# EAGLE schematic adc_cap (EAGLE 7.1.0)
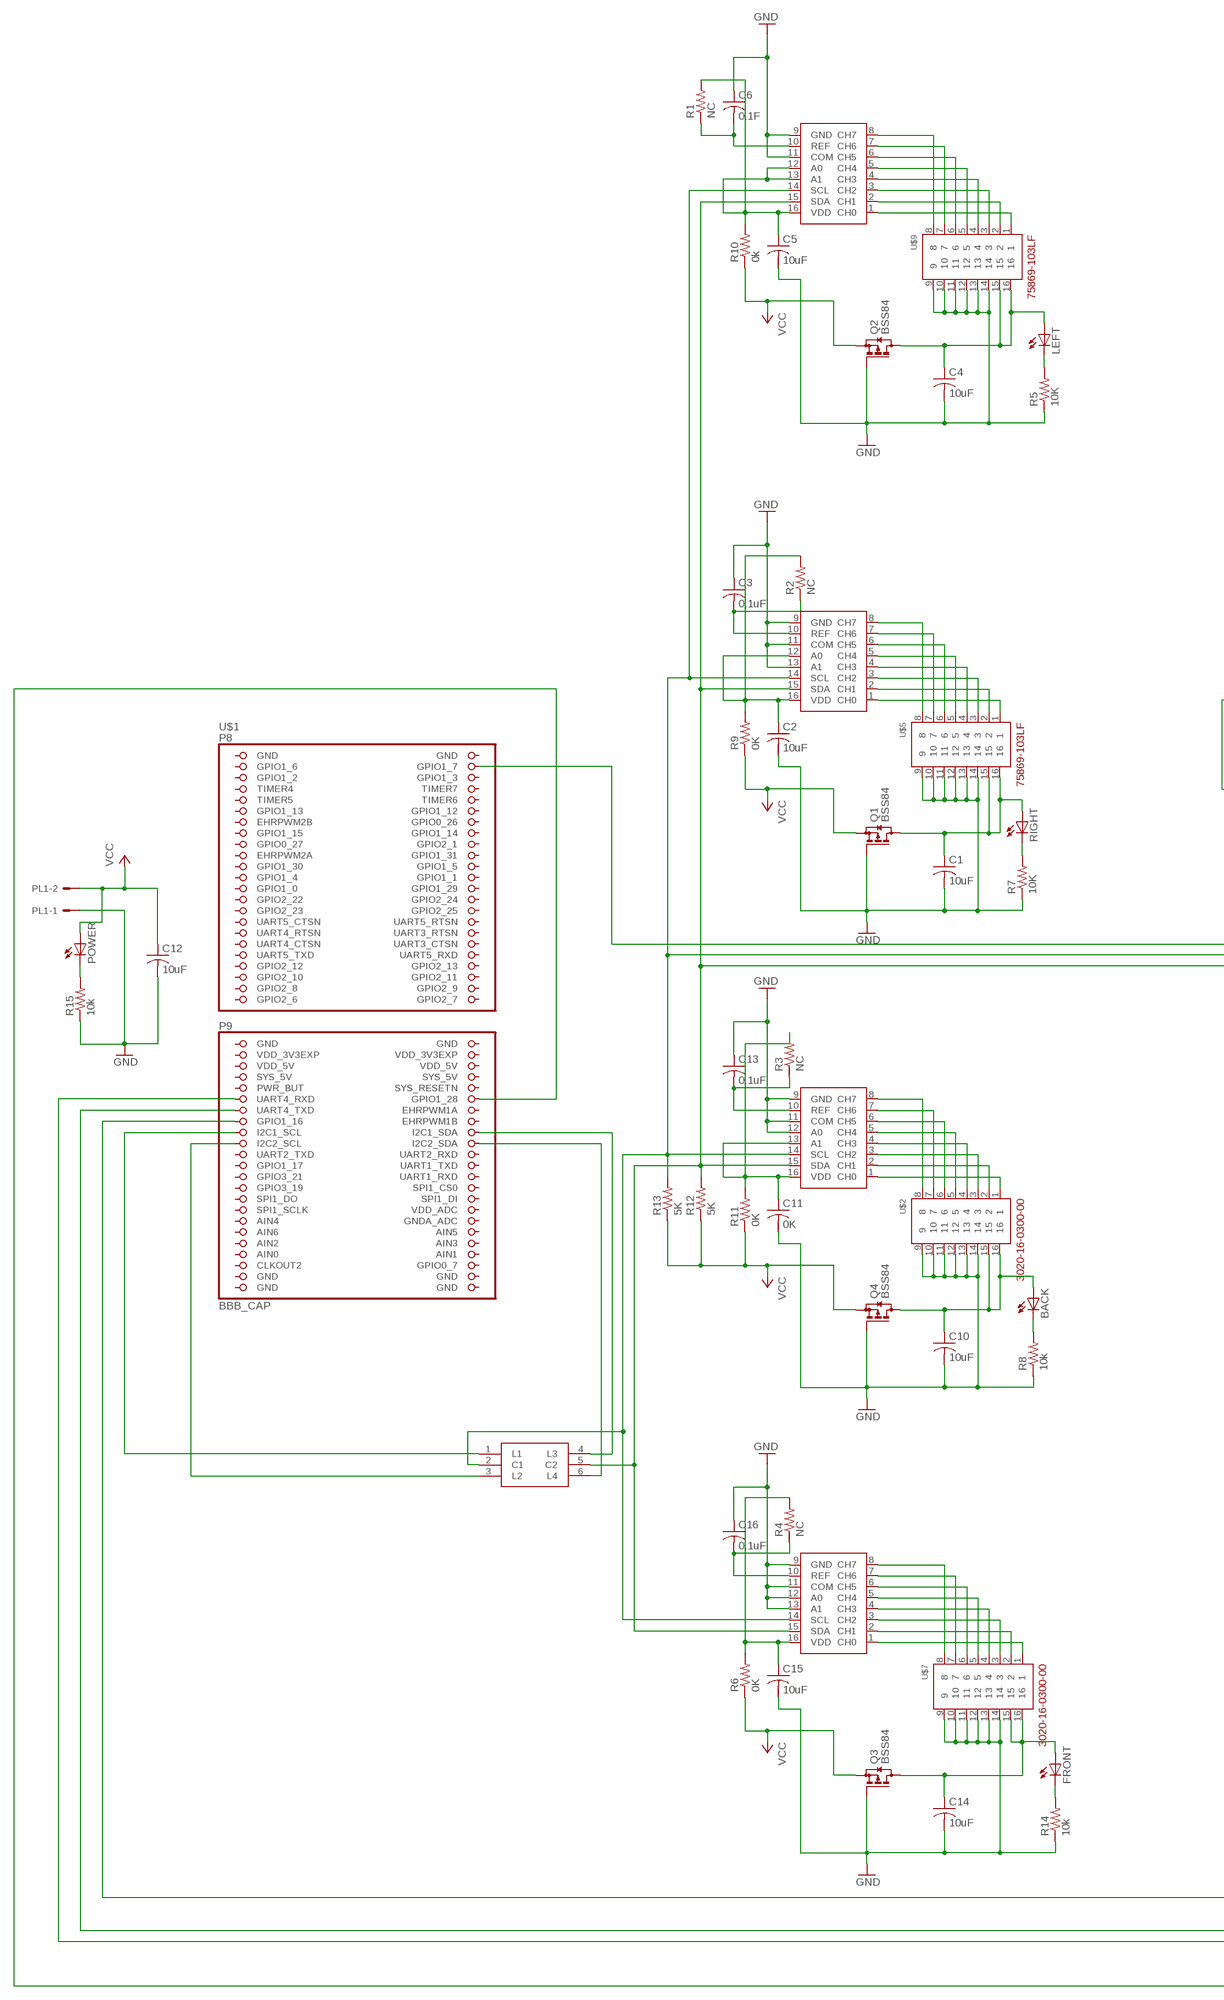
[diagram p0: schematic, sheet 1, part 1 of 2]
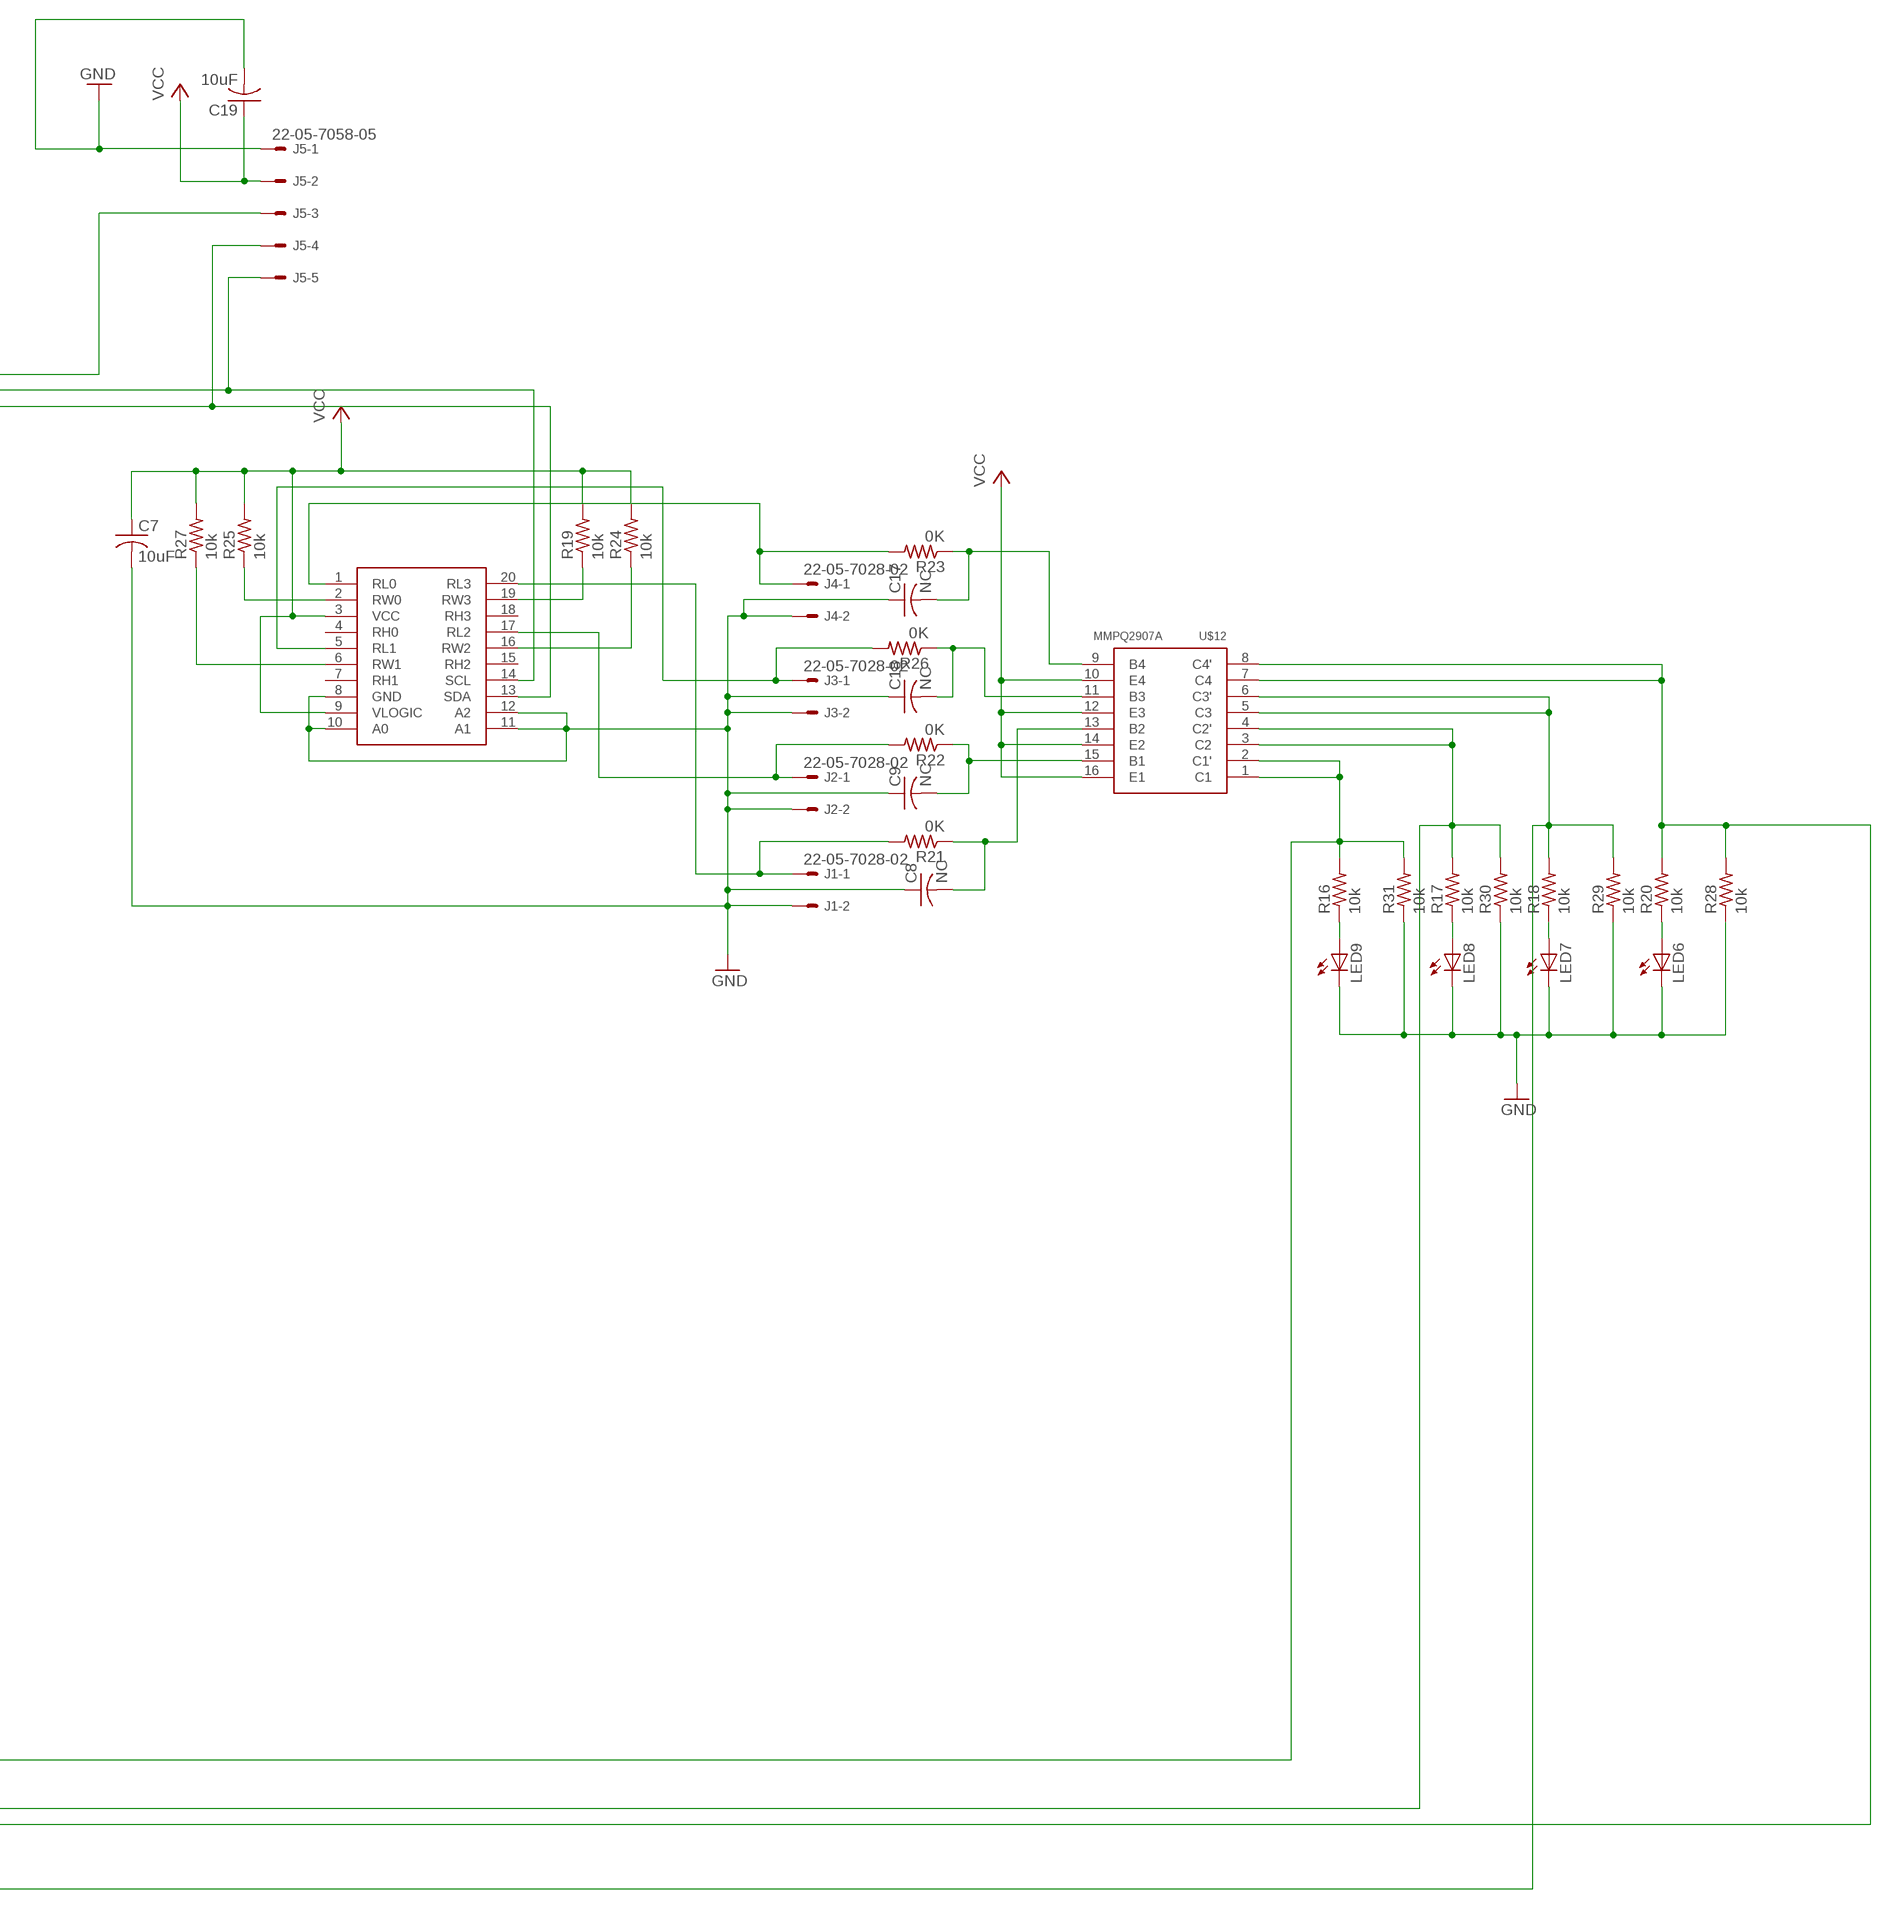
[diagram p1: schematic, sheet 1, part 2 of 2]

## Parts
BACK  LEDSML1206  [SML1206]
C1  10uF  C-USC1206K  [C1206K]
C2  10uF  C-USC1206K  [C1206K]
C3  0.1uF  C-USC1206K  [C1206K]
C4  10uF  C-USC1206K  [C1206K]
C5  10uF  C-USC1206K  [C1206K]
C6  0.1F  C-USC1206K  [C1206K]
C7  10uF  C-USC1206K  [C1206K]
C8  NC  C-USC1206K  [C1206K]
C9  NC  C-USC1206K  [C1206K]
C10  10uF  C-USC1206K  [C1206K]
C11  0K  C-USC1206K  [C1206K]
C12  10uF  C-USC0805  [C0805]
C13  0.1uF  C-USC1206K  [C1206K]
C14  10uF  C-USC1206K  [C1206K]
C15  10uF  C-USC1206K  [C1206K]
C16  0.1uF  C-USC1206K  [C1206K]
C17  NC  C-USC1206K  [C1206K]
C18  NC  C-USC1206K  [C1206K]
C19  10uF  C-USC1206K  [C1206K]
FRONT  LEDSML1206  [SML1206]
J1  22-05-7028-02  [7395-02]
J2  22-05-7028-02  [7395-02]
J3  22-05-7028-02  [7395-02]
J4  22-05-7028-02  [7395-02]
J5  22-05-7058-05  [7395-05]
LED6  LEDSML1206  [SML1206]
LED7  LEDSML1206  [SML1206]
LED8  LEDSML1206  [SML1206]
LED9  LEDSML1206  [SML1206]
LEFT  LEDSML1206  [SML1206]
PL1  555X-2H  [5569-2]
POWER  LEDSML1206  [SML1206]
Q1  BSS84  [SOT23]
Q2  BSS84  [SOT23]
Q3  BSS84  [SOT23]
Q4  BSS84  [SOT23]
R1  NC  R-US_R1206W  [R1206W]
R2  NC  R-US_R1206W  [R1206W]
R3  NC  R-US_R1206W  [R1206W]
R4  NC  R-US_R1206W  [R1206W]
R5  10K  R-US_R1206W  [R1206W]
R6  0K  R-US_R1206W  [R1206W]
R7  10K  R-US_R1206W  [R1206W]
R8  10k  R-US_R1206W  [R1206W]
R9  0K  R-US_R1206W  [R1206W]
R10  0k  R-US_R1206W  [R1206W]
R11  0K  R-US_R1206W  [R1206W]
R12  5K  R-US_R1206W  [R1206W]
R13  5K  R-US_R1206W  [R1206W]
R14  10k  R-US_R1206W  [R1206W]
R15  10k  R-US_R1206W  [R1206W]
R16  10k  R-US_R1206W  [R1206W]
R17  10k  R-US_R1206W  [R1206W]
R18  10k  R-US_R1206W  [R1206W]
R19  10k  R-US_R1206W  [R1206W]
R20  10k  R-US_R1206W  [R1206W]
R21  0K  R-US_R1206W  [R1206W]
R22  0K  R-US_R1206W  [R1206W]
R23  0K  R-US_R1206W  [R1206W]
R24  10k  R-US_R1206W  [R1206W]
R25  10k  R-US_R1206W  [R1206W]
R26  0K  R-US_R1206W  [R1206W]
R27  10k  R-US_R1206W  [R1206W]
R28  10k  R-US_R1206W  [R1206W]
R29  10k  R-US_R1206W  [R1206W]
R30  10k  R-US_R1206W  [R1206W]
R31  10k  R-US_R1206W  [R1206W]
RIGHT  LEDSML1206  [SML1206]
U$1  BBB_CAP  [BBB]
U$2  3020-16-0300-00  [8X2_SMD_HEADER]
U$3  ADS7830  [ADC8_SD]
U$4  ADS7830  [ADC8_SD]
U$5  75869-103LF  [8X2_THROUGH_HOLE_HEADER]
U$6  ADS7830  [ADC8_SD]
U$7  3020-16-0300-00  [8X2_SMD_HEADER]
U$8  ADS7830  [ADC8_SD]
U$9  75869-103LF  [8X2_THROUGH_HOLE_HEADER]
U$10  CAS-220TB  [DPDT_DIP_SWITCH]
U$11  ISL23348_SD  [TSSOP-20]
U$12  MMPQ2907A  [SO1C-16]

## Nets
GND: C1.2 C2.2 C3.1 C4.2 C5.2 C6.1 C7.2 C8.1 C9.1 C10.2 C11.2 C12.2 C13.1 C14.2 C15.2 C16.1 C17.1 C18.1 C19.2 J1.2 J2.2 J3.2 J4.2 J5.1 LED6.C LED7.C LED8.C LED9.C PL1.1 Q1.1(G) Q2.1(G) Q3.1(G) Q4.1(G) R5.1 R7.1 R8.1 R14.1 R28.1 R29.1 R30.1 R31.1 U$2.9 U$2.10 U$2.11 U$2.12 U$2.13 U$2.14 U$3.9(GND) U$3.11(COM) U$3.12(A0) U$4.9(GND) U$4.11(COM) U$4.13(A1) U$5.9 U$5.10 U$5.11 U$5.12 U$5.13 U$5.14 U$6.9(GND) U$6.11(COM) U$7.9 U$7.10 U$7.11 U$7.12 U$7.13 U$7.14 U$8.9(GND) U$8.11(COM) U$8.12(A0) U$8.13(A1) U$9.9 U$9.10 U$9.11 U$9.12 U$9.13 U$9.14 U$11.8(GND) U$11.10(A0) U$11.11(A1) U$11.12(A2)
GND4: R15.1
N$1: U$2.1 U$3.1(CH0)
N$2: J5.4 R12.2 U$3.15(SDA) U$4.15(SDA) U$6.15(SDA) U$8.15(SDA) U$10.5(C2) U$11.13(SDA)
N$3: U$2.2 U$3.2(CH1)
N$4: U$2.3 U$3.3(CH2)
N$5: U$2.4 U$3.4(CH3)
N$6: U$2.5 U$3.5(CH4)
N$7: U$2.6 U$3.6(CH5)
N$8: U$2.7 U$3.7(CH6)
N$9: U$2.8 U$3.8(CH7)
N$10: U$1.P9_18(I2C1_SDA) U$10.4(L3)
N$11: U$1.P9_20(I2C2_SDA) U$10.6(L4)
N$12: C13.2 R3.1 U$3.10(REF)
N$13: J5.5 R13.2 U$3.14(SCL) U$4.14(SCL) U$6.14(SCL) U$8.14(SCL) U$10.2(C1) U$11.14(SCL)
N$14: R19.1 U$11.19(RW3)
N$15: U$4.1(CH0) U$5.1
N$16: U$4.2(CH1) U$5.2
N$17: U$4.3(CH2) U$5.3
N$18: U$4.4(CH3) U$5.4
N$19: U$4.5(CH4) U$5.5
N$20: U$4.6(CH5) U$5.6
N$21: U$4.7(CH6) U$5.7
N$22: U$4.8(CH7) U$5.8
N$23: U$1.P9_17(I2C1_SCL) U$10.1(L1)
N$24: U$1.P9_19(I2C2_SCL) U$10.3(L2)
N$25: C11.1 R3.2 R11.2 U$3.13(A1) U$3.16(VDD)
N$26: C3.2 R2.1 U$4.10(REF)
N$27: C4.1 LEFT.A Q2.3(D) U$9.15 U$9.16
N$28: U$6.1(CH0) U$9.1
N$29: U$6.2(CH1) U$9.2
N$30: U$6.3(CH2) U$9.3
N$31: U$6.4(CH3) U$9.4
N$32: U$6.5(CH4) U$9.5
N$33: U$6.6(CH5) U$9.6
N$34: U$6.7(CH6) U$9.7
N$35: U$6.8(CH7) U$9.8
N$36: R24.1 U$11.16(RW2)
N$37: U$7.1 U$8.1(CH0)
N$38: C2.1 R2.2 R9.2 U$4.12(A0) U$4.16(VDD)
N$39: C6.2 R1.1 U$6.10(REF)
N$40: R25.1 U$11.2(RW0)
N$41: U$7.2 U$8.2(CH1)
N$42: U$7.3 U$8.3(CH2)
N$43: U$7.4 U$8.4(CH3)
N$44: U$7.5 U$8.5(CH4)
N$45: U$7.6 U$8.6(CH5)
N$46: U$7.7 U$8.7(CH6)
N$47: U$7.8 U$8.8(CH7)
N$48: C5.1 R1.2 R10.2 U$6.12(A0) U$6.13(A1) U$6.16(VDD)
N$49: LEFT.C R5.2
N$50: R27.1 U$11.6(RW1)
N$51: C15.1 R4.2 R6.2 U$8.16(VDD)
N$52: C16.2 R4.1 U$8.10(REF)
N$53: C1.1 Q1.3(D) RIGHT.A U$5.15 U$5.16
N$54: R7.2 RIGHT.C
N$55: BACK.A C10.1 Q4.3(D) U$2.15 U$2.16
N$56: BACK.C R8.2
N$57: C14.1 FRONT.A Q3.3(D) U$7.15 U$7.16
N$58: FRONT.C R14.2
N$59: LED8.A R17.1
N$60: POWER.C R15.2
N$61: J4.1 R23.2 U$11.1(RL0)
N$62: J3.1 R26.2 U$11.5(RL1)
N$63: J2.1 R22.2 U$11.17(RL2)
N$64: J1.1 R21.2 U$11.20(RL3)
N$65: LED9.A R16.1
N$66: LED7.A R18.1
N$67: LED6.A R20.1
N$68: C17.2 R23.1 U$12.9(B4)
N$69: C18.2 R26.1 U$12.11(B3)
N$70: C9.2 R22.1 U$12.15(B1)
N$71: C8.2 R21.1 U$12.13(B2)
N$73: J5.3 U$1.P8_4(GPIO1_7)
N$77: R17.2 R30.2 U$1.P9_13(UART4_TXD) U$12.3(C2) U$12.4(C2')
N$78: R20.2 R28.2 U$1.P9_11(UART4_RXD) U$12.7(C4) U$12.8(C4')
N$79: R18.2 R29.2 U$1.P9_12(GPIO1_28) U$12.5(C3) U$12.6(C3')
N$80: R16.2 R31.2 U$1.P9_15(GPIO1_16) U$12.1(C1) U$12.2(C1')
VCC: C7.1 C12.1 C19.1 J5.2 PL1.2 POWER.A Q1.2(S) Q2.2(S) Q3.2(S) Q4.2(S) R6.1 R9.1 R10.1 R11.1 R12.1 R13.1 R19.2 R24.2 R25.2 R27.2 U$11.3(VCC) U$11.9(VLOGIC) U$12.10(E4) U$12.12(E3) U$12.14(E2) U$12.16(E1)
Unconnected: U$1.P8_3(GPIO1_6) U$1.P8_5(GPIO1_2) U$1.P8_6(GPIO1_3) U$1.P8_7(TIMER4) U$1.P8_8(TIMER7) U$1.P8_9(TIMER5) U$1.P8_10(TIMER6) U$1.P8_11(GPIO1_13) U$1.P8_12(GPIO1_12) U$1.P8_13(EHRPWM2B) U$1.P8_14(GPIO0_26) U$1.P8_15(GPIO1_15) U$1.P8_16(GPIO1_14) U$1.P8_17(GPIO0_27) U$1.P8_18(GPIO2_1) U$1.P8_19(EHRPWM2A) U$1.P8_20(GPIO1_31) U$1.P8_21(GPIO1_30) U$1.P8_22(GPIO1_5) U$1.P8_23(GPIO1_4) U$1.P8_24(GPIO1_1) U$1.P8_25(GPIO1_0) U$1.P8_26(GPIO1_29) U$1.P8_27(GPIO2_22) U$1.P8_28(GPIO2_24) U$1.P8_29(GPIO2_23) U$1.P8_30(GPIO2_25) U$1.P8_31(UART5_CTSN) U$1.P8_32(UART5_RTSN) U$1.P8_33(UART4_RTSN) U$1.P8_34(UART3_RTSN) U$1.P8_35(UART4_CTSN) U$1.P8_36(UART3_CTSN) U$1.P8_37(UART5_TXD) U$1.P8_38(UART5_RXD) U$1.P8_39(GPIO2_12) U$1.P8_40(GPIO2_13) U$1.P8_41(GPIO2_10) U$1.P8_42(GPIO2_11) U$1.P8_43(GPIO2_8) U$1.P8_44(GPIO2_9) U$1.P8_45(GPIO2_6) U$1.P8_46(GPIO2_7) U$1.P9_8(SYS_5V) U$1.P9_9(PWR_BUT) U$1.P9_10(SYS_RESETN) U$1.P9_14(EHRPWM1A) U$1.P9_16(EHRPWM1B) U$1.P9_21(UART2_TXD) U$1.P9_22(UART2_RXD) U$1.P9_23(GPIO1_17) U$1.P9_24(UART1_TXD) U$1.P9_25(GPIO3_21) U$1.P9_26(UART1_RXD) U$1.P9_27(GPIO3_19) U$1.P9_28(SPI1_CS0) U$1.P9_29(SPI1_DO) U$1.P9_30(SPI1_DI) U$1.P9_31(SPI1_SCLK) U$1.P9_32(VDD_ADC) U$1.P9_33(AIN4) U$1.P9_34(GNDA_ADC) U$1.P9_35(AIN6) U$1.P9_36(AIN5) U$1.P9_37(AIN2) U$1.P9_38(AIN3) U$1.P9_40(AIN1) U$1.P9_41(CLKOUT2) U$1.P9_42(GPIO0_7) U$11.4(RH0) U$11.7(RH1) U$11.15(RH2) U$11.18(RH3)

## Power pins joined to a net without a drawn wire
AIN0: U$1.P9_39(AIN0)
GND: U$1.P8_1(GND) U$1.P8_2(GND) U$1.P9_1(GND) U$1.P9_2(GND) U$1.P9_43(GND) U$1.P9_44(GND) U$1.P9_45(GND) U$1.P9_46(GND)
SYS_5V: U$1.P9_7(SYS_5V)
VDD_3V3EXP: U$1.P9_3(VDD_3V3EXP) U$1.P9_4(VDD_3V3EXP)
VDD_5V: U$1.P9_5(VDD_5V) U$1.P9_6(VDD_5V)

## Library data of the parts
BACK FRONT LED6-LED9 LEFT POWER RIGHT = led:LED: LED OSRAM: - CHIPLED LG R971, LG N971, LY N971, LG Q971, LY Q971, LO R971, LY R971 LH N974, LH R974 LS Q976, LO Q976, LY Q976 LO Q996 - Hyper CHIPLED LW Q18S LB Q993, LB Q99A, LB R99A - SideLED LS A670, LO A670, LY A670, LG A670, LP A670 LB A673, LV A673, LT A673, LW A673 LH A674 LY A675 LS A676, LA A676, LO A676, LY A676, LW A676 LS A679, LY A679, LG A679 - Hyper Micro SIDELED® LS Y876, LA Y876, LO Y876, LY Y876 LT Y87S - SmartLED LW L88C, LW L88S LB L89C, LB L89S, LG L890 LS L89K, LO L89K, LY L89K LS L896, LA L896, LO L896, LY L896 - TOPLED LS T670, LO T670, LY T670, LG T670, LP T670 LSG T670, LSP T670, LSY T670, LOP T670, LYG T670 LG T671, LOG T671, LSG T671 LB T673, LV T673, LT T673, LW T673 LH T674 LS T676, LA T676, LO T676, LY T676, LB T676, LH T676, LSB T676, LW T676 LB T67C, LV T67C, LT T67C, LS T67K, LO T67K, LY T67K, LW E67C LS E67B, LA E67B, LO E67B, LY E67B, LB E67C, LV E67C, LT E67C LW T67C LS T679, LY T679, LG T679 LS T770, LO T770, LY T770, LG T770, LP T770 LB T773, LV T773, LT T773, LW T773 LH T774 LS E675, LA E675, LY E675, LS T675 LS T776, LA T776, LO T776, LY T776, LB T776 LHGB T686 LT T68C, LB T68C - Hyper Mini TOPLED® LB M676 - Mini TOPLED Santana® LG M470 LS M47K, LO M47K, LY M47K Source: http://www.osram.convergy.de LUXEON: - LUMILED® LXK2-PW12-R00, LXK2-PW12-S00, LXK2-PW14-U00, LXK2-PW14-V00 LXK2-PM12-R00, LXK2-PM12-S00, LXK2-PM14-U00 LXK2-PE12-Q00, LXK2-PE12-R00, LXK2-PE12-S00, LXK2-PE14-T00, LXK2-PE14-U00 LXK2-PB12-K00, LXK2-PB12-L00, LXK2-PB12-M00, LXK2-PB14-N00, LXK2-PB14-P00, LXK2-PB14-Q00 LXK2-PR12-L00, LXK2-PR12-M00, LXK2-PR14-Q00, LXK2-PR14-R00 LXK2-PD12-Q00, LXK2-PD12-R00, LXK2-PD12-S00 LXK2-PH12-R00, LXK2-PH12-S00 LXK2-PL12-P00, LXK2-PL12-Q00, LXK2-PL12-R00 Source: www.luxeon.com KINGBRIGHT: KA-3528ASYC Source: www.kingbright.com
C1-C19 = rcl:C-US: CAPACITOR, American symbol
J1-J4 = con-molex:22-?-02: CONNECTOR wire to board 2.54 mm (.1 inch) pitch header; OC_FARNELL: 9731601; OC_NEWARK: unknown
J5 = con-molex:22-?-05: CONNECTOR wire to board 2.54 mm (.1 inch) pitch header; OC_FARNELL: unknown; OC_NEWARK: unknown
PL1 = con-molex-2:555X-2: Mini FIT connector 2 way
Q1-Q4 = transistor-small-signal:BSS84: P-CHANNEL MOS FET
R1-R31 = rcl:R-US_: RESISTOR, American symbol
U$1 = TIparts:BBB_CAP
U$2 U$7 = TIparts:3020-16-0300-00
U$3 U$4 U$6 U$8 = ADC128D818:ADS7830
U$5 U$9 = TIparts:75869-103LF
U$10 = TIparts:CAS-220TB
U$11 = TIparts:ISL23348_SD
U$12 = TIparts:MMPQ2907A

## Net classes
0 default: width 0.203 mm, drill 0.381 mm, clearance 0.254 mm